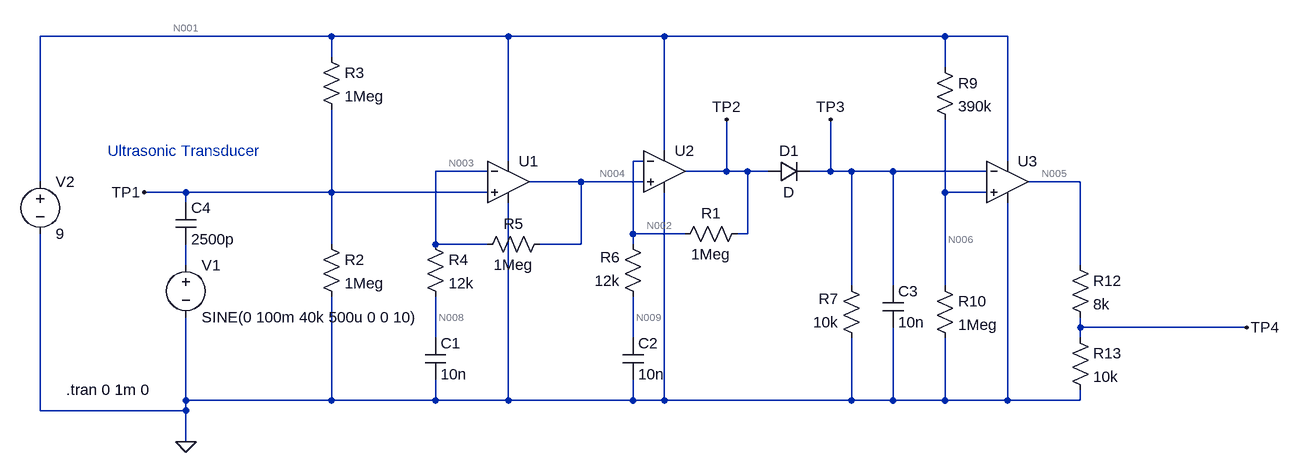
[diagram p0: schematic Ultrasonic Transducer Reciever Circuit.asc]
Ultrasonic Transducer Reciever Circuit.asc, the LTspice schematic file:
Version 4
SHEET 1 1132 680
WIRE -336 -96 -784 -96
WIRE -64 -96 -336 -96
WIRE 176 -96 -64 -96
WIRE 608 -96 176 -96
WIRE 704 -96 608 -96
WIRE -336 -64 -336 -96
WIRE 608 -48 608 -96
WIRE 176 80 176 -96
WIRE -64 96 -64 -96
WIRE 144 96 128 96
WIRE 704 96 704 -96
WIRE -96 112 -176 112
WIRE 272 112 272 32
WIRE 272 112 208 112
WIRE 304 112 272 112
WIRE 336 112 304 112
WIRE 432 112 432 32
WIRE 432 112 400 112
WIRE 464 112 432 112
WIRE 528 112 464 112
WIRE 672 112 528 112
WIRE -784 128 -784 -96
WIRE 48 128 -32 128
WIRE 144 128 48 128
WIRE 816 128 736 128
WIRE -560 144 -624 144
WIRE -336 144 -336 16
WIRE -336 144 -560 144
WIRE -96 144 -336 144
WIRE 608 144 608 32
WIRE 672 144 608 144
WIRE -560 160 -560 144
WIRE 128 208 128 96
WIRE 208 208 128 208
WIRE 304 208 304 112
WIRE 304 208 288 208
WIRE -336 224 -336 144
WIRE -176 224 -176 112
WIRE -96 224 -176 224
WIRE 48 224 48 128
WIRE 48 224 -16 224
WIRE 128 224 128 208
WIRE -560 256 -560 224
WIRE 816 256 816 128
WIRE 464 288 464 112
WIRE 528 288 528 112
WIRE 608 288 608 144
WIRE 816 352 816 336
WIRE 1072 352 816 352
WIRE -176 368 -176 304
WIRE 128 368 128 304
WIRE 816 368 816 352
WIRE -560 464 -560 336
WIRE -336 464 -336 304
WIRE -336 464 -560 464
WIRE -176 464 -176 432
WIRE -176 464 -336 464
WIRE -64 464 -64 160
WIRE -64 464 -176 464
WIRE 128 464 128 432
WIRE 128 464 -64 464
WIRE 176 464 176 144
WIRE 176 464 128 464
WIRE 464 464 464 368
WIRE 464 464 176 464
WIRE 528 464 528 352
WIRE 528 464 464 464
WIRE 608 464 608 368
WIRE 608 464 528 464
WIRE 704 464 704 160
WIRE 704 464 608 464
WIRE 816 464 816 448
WIRE 816 464 704 464
WIRE -784 480 -784 208
WIRE -560 480 -560 464
WIRE -560 480 -784 480
WIRE -560 528 -560 480
FLAG -560 528 0
FLAG -624 144 TP1
FLAG 1072 352 TP4
FLAG 272 32 TP2
FLAG 432 32 TP3
SYMBOL res -352 208 R0
SYMATTR InstName R2
SYMATTR Value 1Meg
SYMBOL res -352 -80 R0
SYMATTR InstName R3
SYMATTR Value 1Meg
SYMBOL res -192 208 R0
SYMATTR InstName R4
SYMATTR Value 12k
SYMBOL res 0 208 R90
WINDOW 0 0 56 VBottom 2
WINDOW 3 32 56 VTop 2
SYMATTR InstName R5
SYMATTR Value 1Meg
SYMBOL cap -192 368 R0
SYMATTR InstName C1
SYMATTR Value 10n
SYMBOL res 304 192 R90
WINDOW 0 0 56 VBottom 2
WINDOW 3 32 56 VTop 2
SYMATTR InstName R1
SYMATTR Value 1Meg
SYMBOL res 144 320 R180
WINDOW 0 36 76 Left 2
WINDOW 3 36 40 Left 2
SYMATTR InstName R6
SYMATTR Value 12k
SYMBOL cap 112 368 R0
SYMATTR InstName C2
SYMATTR Value 10n
SYMBOL res 480 384 R180
WINDOW 0 36 76 Left 2
WINDOW 3 36 40 Left 2
SYMATTR InstName R7
SYMATTR Value 10k
SYMBOL cap 512 288 R0
SYMATTR InstName C3
SYMATTR Value 10n
SYMBOL res 592 -64 R0
SYMATTR InstName R9
SYMATTR Value 390k
SYMBOL res 592 272 R0
SYMATTR InstName R10
SYMATTR Value 1Meg
SYMBOL res 800 240 R0
SYMATTR InstName R12
SYMATTR Value 8k
SYMBOL res 800 352 R0
SYMATTR InstName R13
SYMATTR Value 10k
SYMBOL cap -576 160 R0
SYMATTR InstName C4
SYMATTR Value 2500p
SYMBOL voltage -560 240 R0
WINDOW 123 0 0 Left 2
WINDOW 39 0 0 Left 2
SYMATTR InstName V1
SYMATTR Value SINE(0 100m 40k 500u 0 0 10)
SYMBOL Opamps\\UniversalOpamp2 -64 128 R0
SYMATTR InstName U1
SYMBOL Opamps\\UniversalOpamp2 176 112 R0
SYMATTR InstName U2
SYMBOL Opamps\\UniversalOpamp2 704 128 R0
SYMATTR InstName U3
SYMBOL voltage -784 112 R0
WINDOW 123 0 0 Left 2
WINDOW 39 0 0 Left 2
SYMATTR InstName V2
SYMATTR Value 9
SYMBOL diode 336 128 R270
WINDOW 0 32 32 VTop 2
WINDOW 3 0 32 VBottom 2
SYMATTR InstName D1
TEXT -680 80 Left 2 ;Ultrasonic Transducer
TEXT -744 448 Left 2 !.tran 0 1m 0

The netlist it stands for:
* Ultrasonic Transducer Reciever Circuit.asc
R2 TP1 0 1Meg
R3 N001 TP1 1Meg
R4 N003 N008 12k
R5 N004 N003 1Meg
C1 N008 0 10n
R1 TP2 N002 1Meg
R6 N009 N002 12k
C2 N009 0 10n
R7 0 TP3 10k
C3 TP3 0 10n
R9 N001 N006 390k
R10 N006 0 1Meg
R12 N005 TP4 8k
R13 TP4 0 10k
C4 TP1 N007 2500p
V1 N007 0 SINE(0 100m 40k 500u 0 0 10)
XU1 TP1 N003 N001 0 N004 level.2 Avol=1Meg GBW=10Meg Slew=10Meg ilimit=25m rail=0 Vos=0 phimargin=45 en=0 enk=0 in=0 ink=0 Rin=500Meg  ; pins IN+ IN- V+ V- OUT
XU2 N004 N002 N001 0 TP2 level.2 Avol=1Meg GBW=10Meg Slew=10Meg ilimit=25m rail=0 Vos=0 phimargin=45 en=0 enk=0 in=0 ink=0 Rin=500Meg  ; pins IN+ IN- V+ V- OUT
XU3 N006 TP3 N001 0 N005 level.2 Avol=1Meg GBW=10Meg Slew=10Meg ilimit=25m rail=0 Vos=0 phimargin=45 en=0 enk=0 in=0 ink=0 Rin=500Meg  ; pins IN+ IN- V+ V- OUT
V2 N001 0 9
D1 TP2 TP3 D
.model D D
.lib standard.dio
* Ultrasonic Transducer
.tran 0 1m 0
.lib UniversalOpamps2.sub
.backanno
.end

* Results of the author's LTspice run, read from the files saved beside the schematic
* Operating Point, zero values left out:
*   V(tp1) = 4.5 V
*   V(n001) = 9 V
*   V(n003) = 4.5 V
*   V(n008) = 4.5 V
*   V(n004) = 4.5 V
*   V(tp2) = 4.5 V
*   V(n002) = 4.5 V
*   V(n009) = 4.5 V
*   V(tp3) = 3.869 V
*   V(n006) = 6.474 V
*   V(n005) = 8.995 V
*   V(tp4) = 4.997 V
*   I(C3) = 52.2 pA
*   I(C2) = -7.402 pA
*   I(D1) = 386.9 µA
*   I(R13) = 499.7 µA
*   I(R12) = 499.7 µA
*   I(R10) = 6.474 µA
*   I(R9) = 6.478 µA
*   I(R7) = -386.9 µA
*   I(R6) = 7.402 pA
*   I(R1) = -7.4 pA
*   I(R3) = 4.5 µA
*   I(R2) = 4.5 µA
*   I(V2) = -1.645 mA
*   Ix(u1:3) = 450 µA
*   Ix(u1:4) = -450 µA
*   Ix(u1:5) = 1.113 pA
*   Ix(u2:3) = 683.3 µA
*   Ix(u2:4) = -296.3 µA
*   Ix(u2:5) = -386.9 µA
*   Ix(u3:1) = 3.947 nA
*   Ix(u3:2) = -1.261 nA
*   Ix(u3:3) = 500.7 µA
*   Ix(u3:4) = -1.062 µA
*   Ix(u3:5) = -499.7 µA
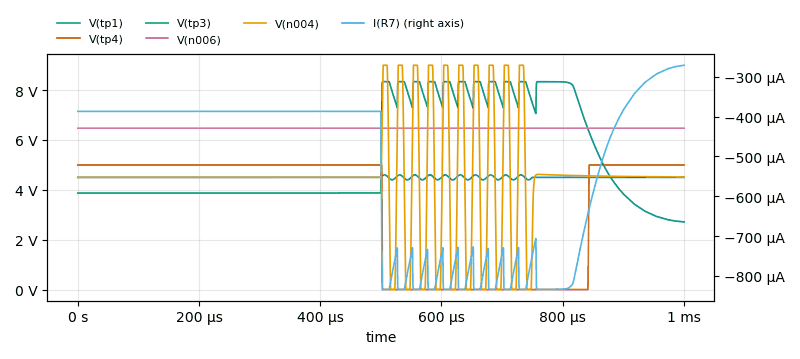
[diagram p1: Transient Analysis of Ultrasonic Transducer Reciever Circuit.asc, plotted from the saved traces]
* Transient Analysis, 1 run:
*   V(tp1): min 4.4 V, max 4.599 V, average 4.5 V, rms 4.5 V, last 4.5 V
*   V(tp4): min 5.958 µV, max 4.997 V, average 3.295 V, rms 4.057 V, last 4.997 V
*   V(tp3): min 2.712 V, max 8.34 V, average 5.269 V, rms 5.649 V, last 2.712 V
*   V(n006): min 6.474 V, max 6.474 V, average 6.474 V, rms 6.474 V, last 6.474 V
*   V(n004): min 76.34 µV, max 9 V, average 4.499 V, rms 4.894 V, last 4.515 V
*   I(R7): min -834 µA, max -271.2 µA, average -526.9 µA, rms 564.9 µA, last -271.2 µA